# Altium schematic sheet NEB_PSU_SPARTAN.SCHDOC
size A4; Organization: Altium Limited; Address1: L3, 12a Rodborough Rd; Address2: Frenchs Forest; Address3: NSW; Address4: Australia 2086; DocumentNumber: 7; SheetNumber: 7; SheetTotal: 10
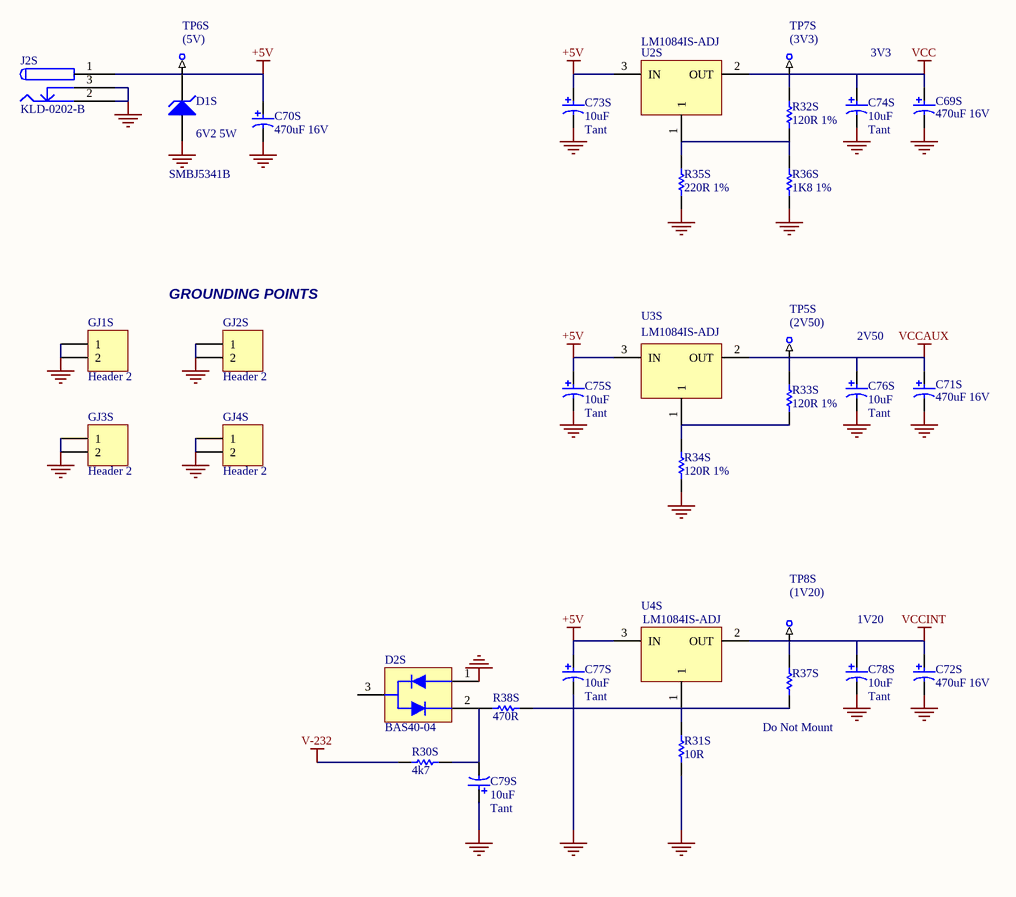
[diagram p0: NEB_PSU_SPARTAN.SCHDOC]

## Parts
C69S  470uF 16V  [RB8/3.5]
C70S  470uF 16V  [RB8/3.5]
C71S  470uF 16V  [RB8/3.5]
C72S  470uF 16V  [RB8/3.5]
C73S  10uF  Capacitor Type: Tant  [MCCT-B]
C74S  10uF  Capacitor Type: Tant  [MCCT-B]
C75S  10uF  Capacitor Type: Tant  [MCCT-B]
C76S  10uF  Capacitor Type: Tant  [MCCT-B]
C77S  10uF  Capacitor Type: Tant  [MCCT-B]
C78S  10uF  Capacitor Type: Tant  [MCCT-B]
C79S  10uF  Capacitor Type: Tant  [MCCT-B]
D1S  SMBJ5341B  Part Description: 6V2 5W  [DO214]
D2S  BAS40-04  [SO-G3]
GJ1S  Header 2  [HDR1X2]
GJ2S  Header 2  [HDR1X2]
GJ3S  Header 2  [HDR1X2]
GJ4S  Header 2  [HDR1X2]
J2S  KLD-0202-B  [KLD-0202]
R30S  4k7  [CR2012-0805]
R31S  10R  [CR2012-0805]
R32S  120R 1%  [CR2012-0805]
R33S  120R 1%  [CR2012-0805]
R34S  120R 1%  [CR2012-0805]
R35S  220R 1%  [CR2012-0805]
R36S  1K8 1%  [CR2012-0805]
R37S  Do Not Mount  [CR2012-0805]
R38S  470R  [CR2012-0805]
TP5S  (2V50)  [TestPin]  (no BOM)
TP6S  (5V)  [TestPin]  (no BOM)
TP7S  (3V3)  [TestPin]  (no BOM)
TP8S  (1V20)  [TestPin]  (no BOM)
U2S  LM1084IS-ADJ  [TO-263]
U3S  LM1084IS-ADJ  [TO-263]
U4S  LM1084IS-ADJ  [TO-263]

## Nets
+5V: C70S.1 C73S.1 C75S.1 C77S.1 D1S.2(K) J2S.1 J2S.1A J2S.1B TP6S.1 U2S.3(IN) U3S.3(IN) U4S.3(IN)
GND: C69S.2 C70S.2 C71S.2 C72S.2 C73S.2 C74S.2 C75S.2 C76S.2 C77S.2 C78S.2 C79S.1 D1S.1(A) D2S.1 GJ1S.1 GJ1S.2 GJ2S.1 GJ2S.2 GJ3S.1 GJ3S.2 GJ4S.1 GJ4S.2 J2S.2 J2S.2A J2S.2B J2S.3 J2S.3A J2S.3B R31S.1 R34S.1 R35S.1 R36S.1
V-232: R30S.2
VCC: C69S.1 C74S.1 R32S.2 TP7S.1 U2S.2(OUT) U2S.4(HeatSink)
VCCAUX: C71S.1 C76S.1 R33S.2 TP5S.1 U3S.2(OUT) U3S.4(HeatSink)
VCCINT: C72S.1 C78S.1 R37S.2 TP8S.1 U4S.2(OUT) U4S.4(HeatSink)
NetC79S_2: C79S.2 D2S.2 R30S.1 R38S.2
NetR31S_2: R31S.2 R37S.1 R38S.1 U4S.1
NetR32S_1: R32S.1 R35S.2 R36S.2 U2S.1
NetR33S_1: R33S.1 R34S.2 U3S.1

Not connected (* = marked no-connect by the designer): D2S 3

## Notes on the sheet
- 3V3
- (near GJ2S) GROUNDING POINTS
- 2V50
- 1V20
- Title
- Size:
- Date:
- A4
- Number:
- Time:
- Revision:
- Sheet
- of
- File:

## Library data of the parts
C69S C70S C71S C72S C73S C74S C75S C76S C77S C78S C79S = CAP_POLAR: Polar Capacitor; Fitted: True; Supplier: FARNELL
  C69S C70S C71S C72S: Supplier Code: 361-8493
  C73S C74S C75S C76S C77S C78S C79S: Supplier Code: 967-117
D1S = BZG03C13: Zener Diode, 6.2V, 5W; Manufacturer: Microsemi; Fitted: True; Revision: 31-Oct-2003
D2S = BAS40-04: Shottky Diode Pair; Fitted: True
GJ1S GJ2S GJ3S GJ4S = Header 2: Header, 2-Pin; Manufacturer: Generic Components; Class I: Connector; Fitted: True; Revision: July-2002: Re-released for DXP Platform.; Publisher: Altium Limited
J2S = KLD-0202-B: Low Voltage Power Supply Connector; Manufacturer: Kycon; Fitted: True
R30S R31S R32S R33S R34S R35S R36S R37S R38S = RES: Resistor; Fitted: True
TP5S TP6S TP7S TP8S = TestPin
U2S U3S U4S = LM1084IS-ADJ: 5A Low Dropout Positive Regulators; Manufacturer: National Semi; Published: 5-Jan-2004; Datasheet: Latest Revision: Aug-2002; Publisher: Altium Limited